# Altium schematic sheet temp.SchDoc
size A4
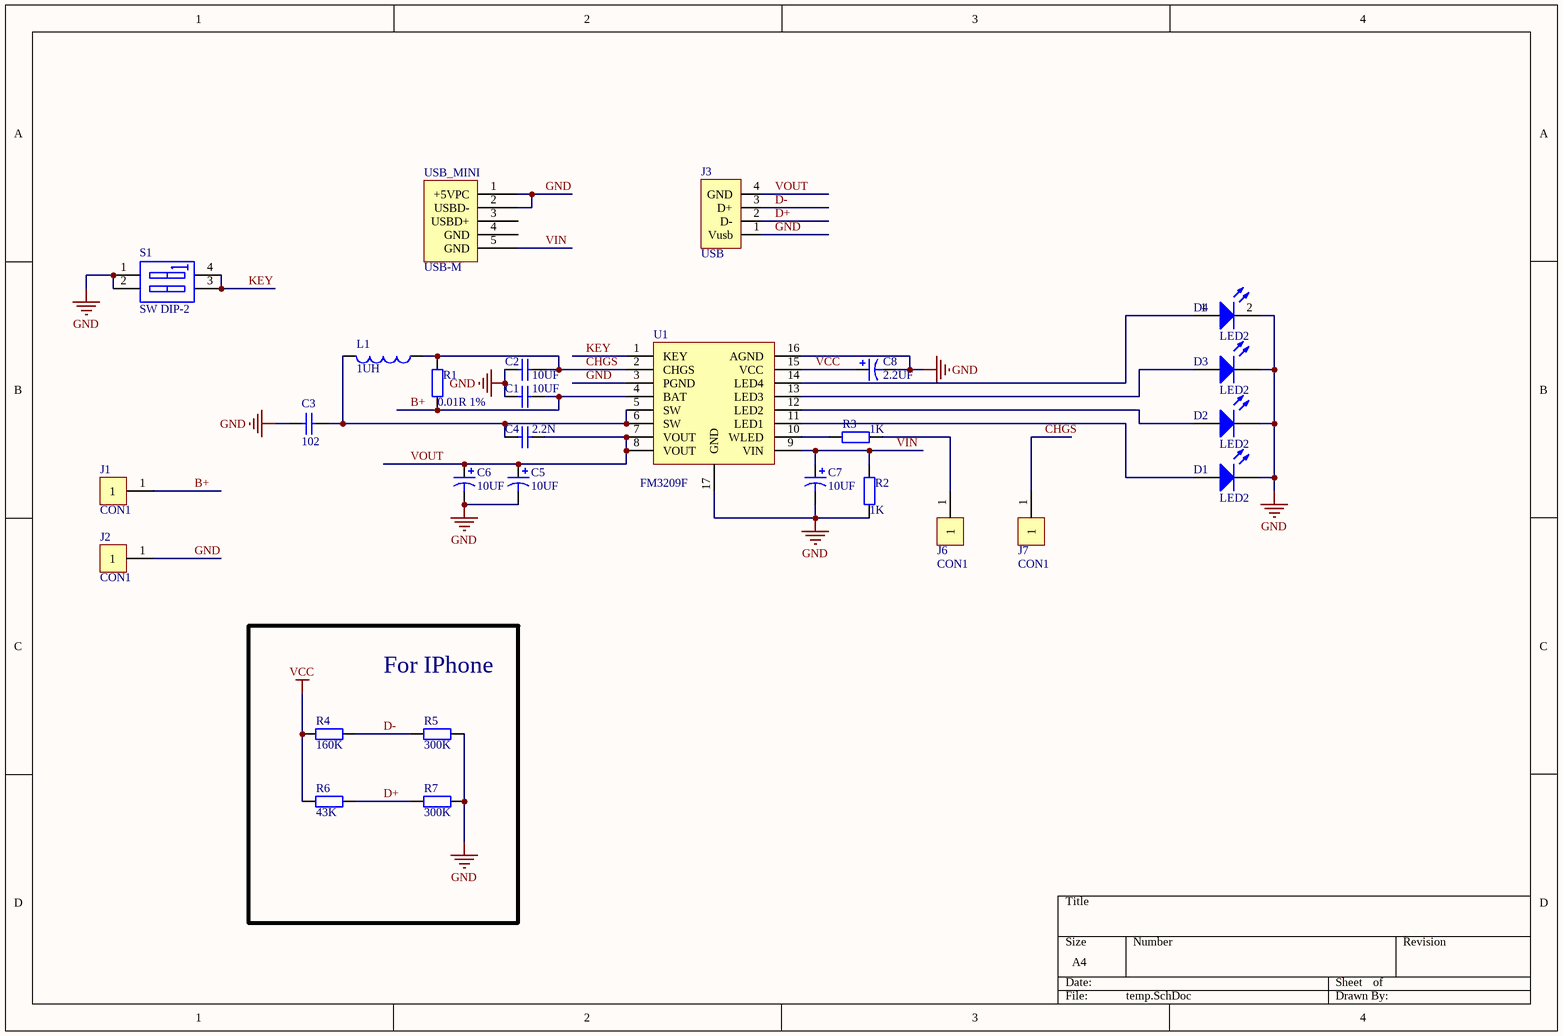
[diagram p0: temp.SchDoc]

## Parts
C1  10UF  [CAPMP3528X210N]
C2  10UF  [CAPMP3528X210N]
C3  102  [0603_CAP]
C4  2.2N  [0603_CAP]
C5  10UF  [CAPMP3528X210N]
C6  10UF  [CAPMP3528X210N]
C7  10UF  [CAPMP3528X210N]
C8  2.2UF  [0603_CAP]
D1  LED2  [LED_0805]
D2  LED2  [LED_0805]
D3  LED2  [LED_0805]
D4  LED2  [LED_0805]
J1  CON1  [BAT]
J2  CON1  [BAT]
J3  USB  [USB4]
J6  CON1  [PIN]
J7  CON1  [PIN]
L1  1UH  [4030]
R1  0.01R 1%  [1206_RES]
R2  1K  [0805_Res]
R3  1K  [0805_Res]
R4  160K  [0805_Res]
R5  300K  [0805_Res]
R6  43K  [0805_Res]
R7  300K  [0805_Res]
S1  SW DIP-2  [BUTTON 6 * 6]
U1  FM3209F  [ESOP - 16]
USB_MINI  USB-M  [Micro USB]

## Nets
GND: C1.1 C2.1 C3.2 C5.2 C6.2 C7.2 C8.2 D1.2(K) D2.2(K) D3.2(K) D4.2(K) J2.1 J3.1(Vusb) R2.1 R5.2 R7.2 S1.1(A1) S1.2(A2) U1.3(PGND) U1.16(AGND) U1.17(GND) USB_MINI.1(+5VPC) USB_MINI.2(USBD-)
VCC: C8.1 R4.1 R6.1 U1.15(VCC)
B+: C1.2 J1.1 R1.1 U1.4(BAT)
CHGS: C2.2 J7.1 L1.1 R1.2 U1.2(CHGS)
D+: J3.2(D-) R6.2 R7.1
D-: J3.3(D+) R4.2 R5.1
KEY: S1.3(B2) S1.4(B1) U1.1(KEY)
VIN: C7.1 R2.2 U1.9(VIN) USB_MINI.5(GND)
VOUT: C4.2 C5.1 C6.1 J3.4(GND) U1.7(VOUT) U1.8(VOUT)
NetC3_1: C3.1 C4.1 L1.2 U1.5(SW) U1.6(SW)
NetD1_1: D1.1(A) U1.11(LED1)
NetD2_1: D2.1(A) U1.12(LED2)
NetD3_1: D3.1(A) U1.13(LED3)
NetD4_1: D4.1(A) U1.14(LED4)
NetJ6_1: J6.1 R3.1
NetR3_2: R3.2 U1.10(WLED)

Not connected (* = marked no-connect by the designer): USB_MINI 3(USBD+) 4(GND)

## Notes on the sheet
- For IPhone

## Library data of the parts
C1-C4 = Cap: Capacitor; Value: 100pF; Published: 8-Jun-2000; LatestRevisionDate: 17-Jul-2002; LatestRevisionNote: Re-released for DXP Platform.; PackageReference: RAD-0.3; Publisher: Altium Limited; PackageDescription: Radial Cap, Thru-Hole; 2 Leads; 0.3 in Pin Spacing
C5-C8 = Cap Pol1: Polarized Capacitor (Radial); Value: 100pF; Published: 8-Jun-2000; LatestRevisionDate: 17-Jul-2002; LatestRevisionNote: Re-released for DXP Platform.; PackageReference: RB7.6-15; Publisher: Altium Limited; PackageDescription: Polarized Capacitor (Radial); 2 Leads
D1-D4 = LED2: Typical RED, GREEN, YELLOW, AMBER GaAs LED; Published: 8-Jun-2000; LatestRevisionDate: 17-Jul-2002; LatestRevisionNote: Re-released for DXP Platform.; PackageVersion: Feb-2002; PackageReference: 3.2X1.6X1.1; Publisher: Altium Limited; PackageDescription: SM LED; 2 Flat Leads
L1 = Inductor: Code_IEC: 1005; Value: 10mH; Published: 8-Jun-2000; LatestRevisionDate: 29-May-2009; LatestRevisionNote: IPC-7351 Footprint Added.; PackageReference: 0402-A; Publisher: Altium Limited; PackageDescription: Chip Inductor; Code_JEITA: 0402
R1 R4-R7 = Res2: Resistor; Value: 1K; Published: 8-Jun-2000; LatestRevisionDate: 17-Jul-2002; LatestRevisionNote: Re-released for DXP Platform.; PackageReference: AXIAL-0.4; Publisher: Altium Limited; PackageDescription: Axial Device, Thru-Hole; 2 Leads; 0.4 in Pin Spacing
R2 R3 = Res2: Resistor; Published: 8-Jun-2000; LatestRevisionDate: 17-Jul-2002; LatestRevisionNote: Re-released for DXP Platform.; PackageReference: AXIAL-0.4; Publisher: Altium Limited; PackageDescription: Axial Device, Thru-Hole; 2 Leads; 0.4 in Pin Spacing; Value: 1K
S1 = SW DIP-2: DIP Switch, 2 Position, SPST; Published: 24-Mar-1999; LatestRevisionDate: 17-Jul-2002; LatestRevisionNote: Re-released for DXP Platform.; PackageReference: DIP-4; Publisher: Altium Limited